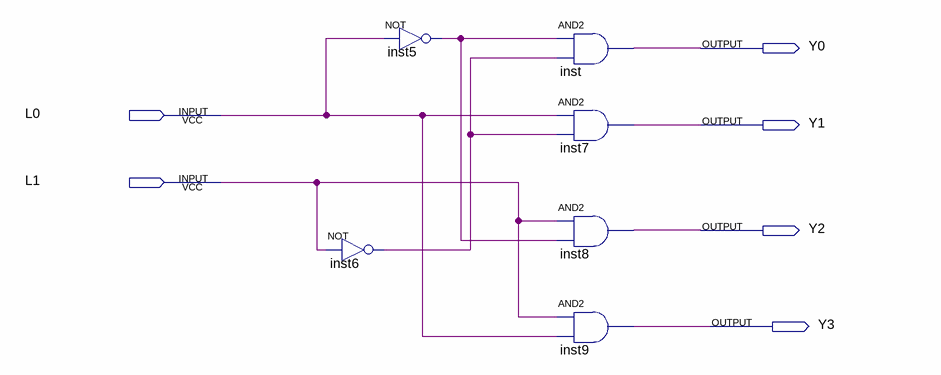
[diagram p0: schematic sheet]
// Quartus schematic 24decoder.bdf as structural Verilog: 6 symbols, 6 pins
module \24decoder  (
  input  L0,
  input  L1,
  output Y0,
  output Y1,
  output Y2,
  output Y3
);

  wire inst5_out, inst6_out;

  not inst5 (inst5_out, L0);
  not inst6 (inst6_out, L1);
  and inst (Y0, inst5_out, inst6_out);
  and inst7 (Y1, L0, inst6_out);
  and inst8 (Y2, L1, inst5_out);
  and inst9 (Y3, L1, L0);
endmodule
